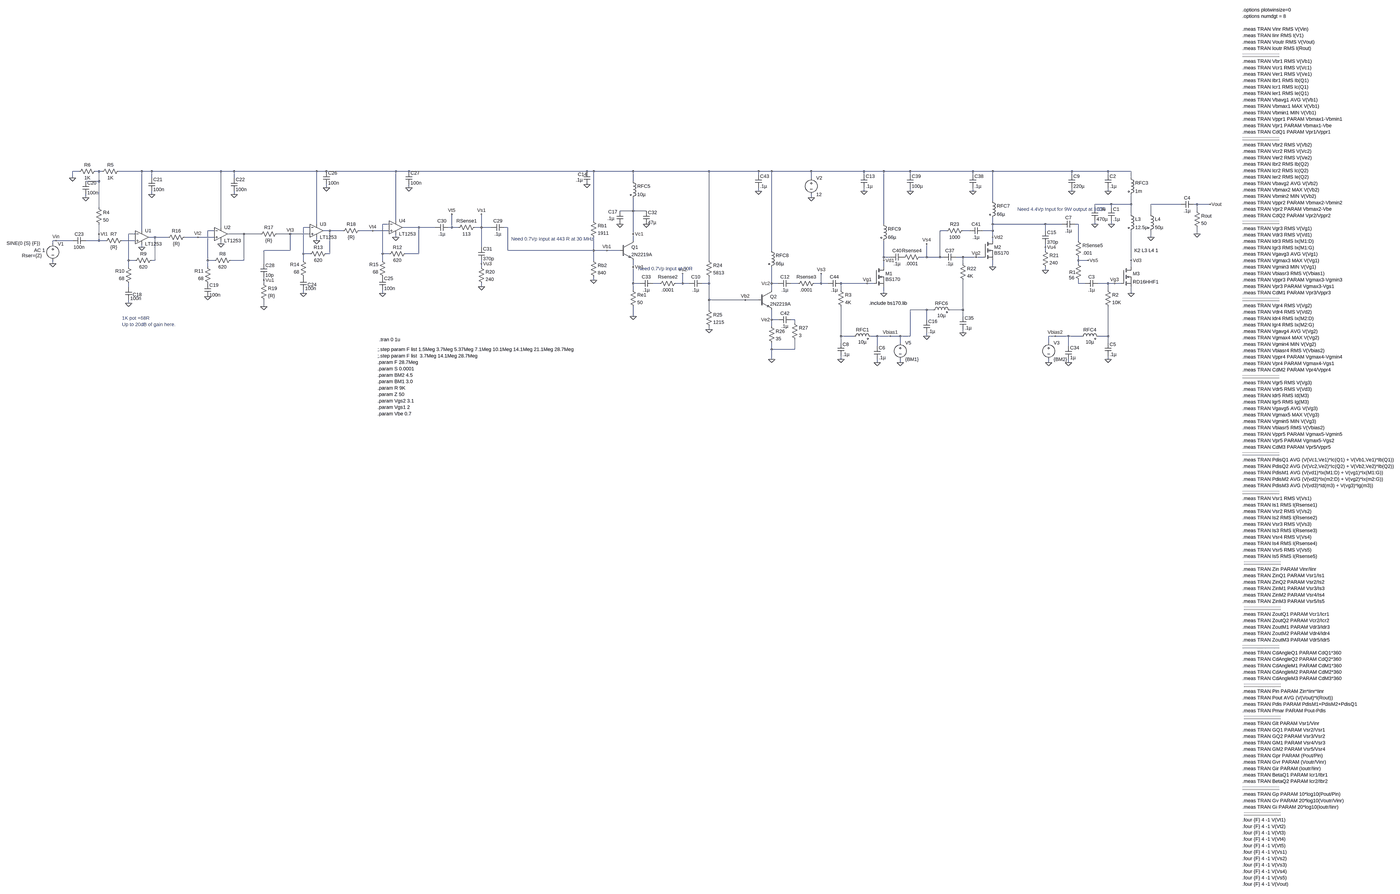
[diagram p0: schematic LT1253 2N2219 CC BS170x2 RD16HHF Power Amp Testing.asc, whole sheet]
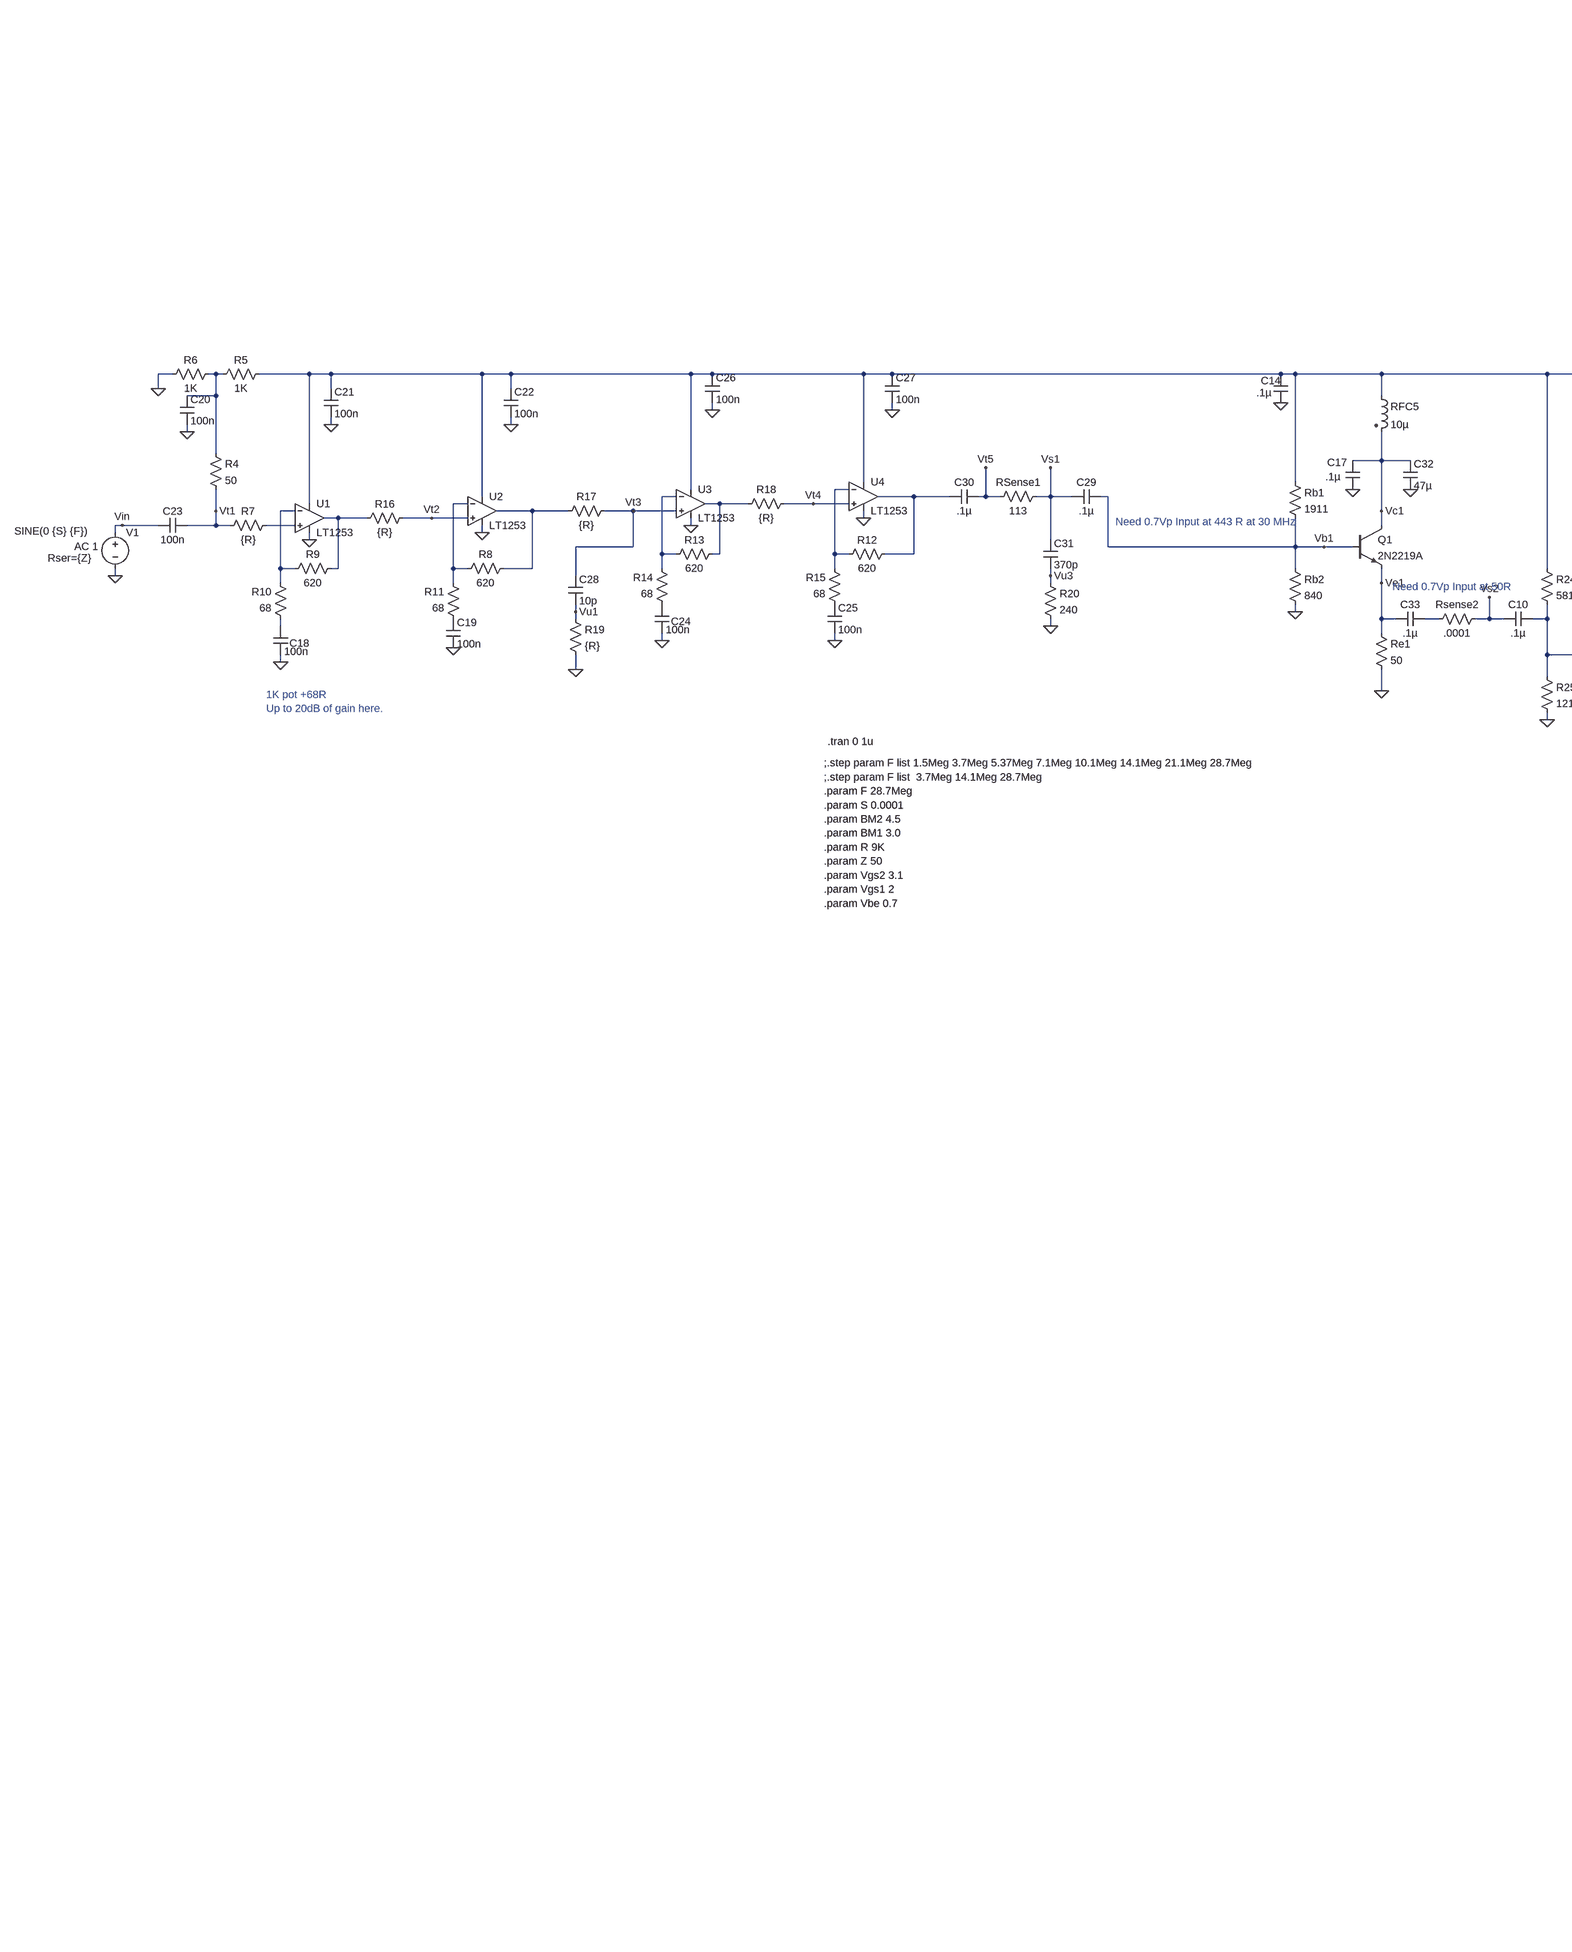
[diagram p1: schematic LT1253 2N2219 CC BS170x2 RD16HHF Power Amp Testing.asc, part, row 1 of 1, column 1 of 2]
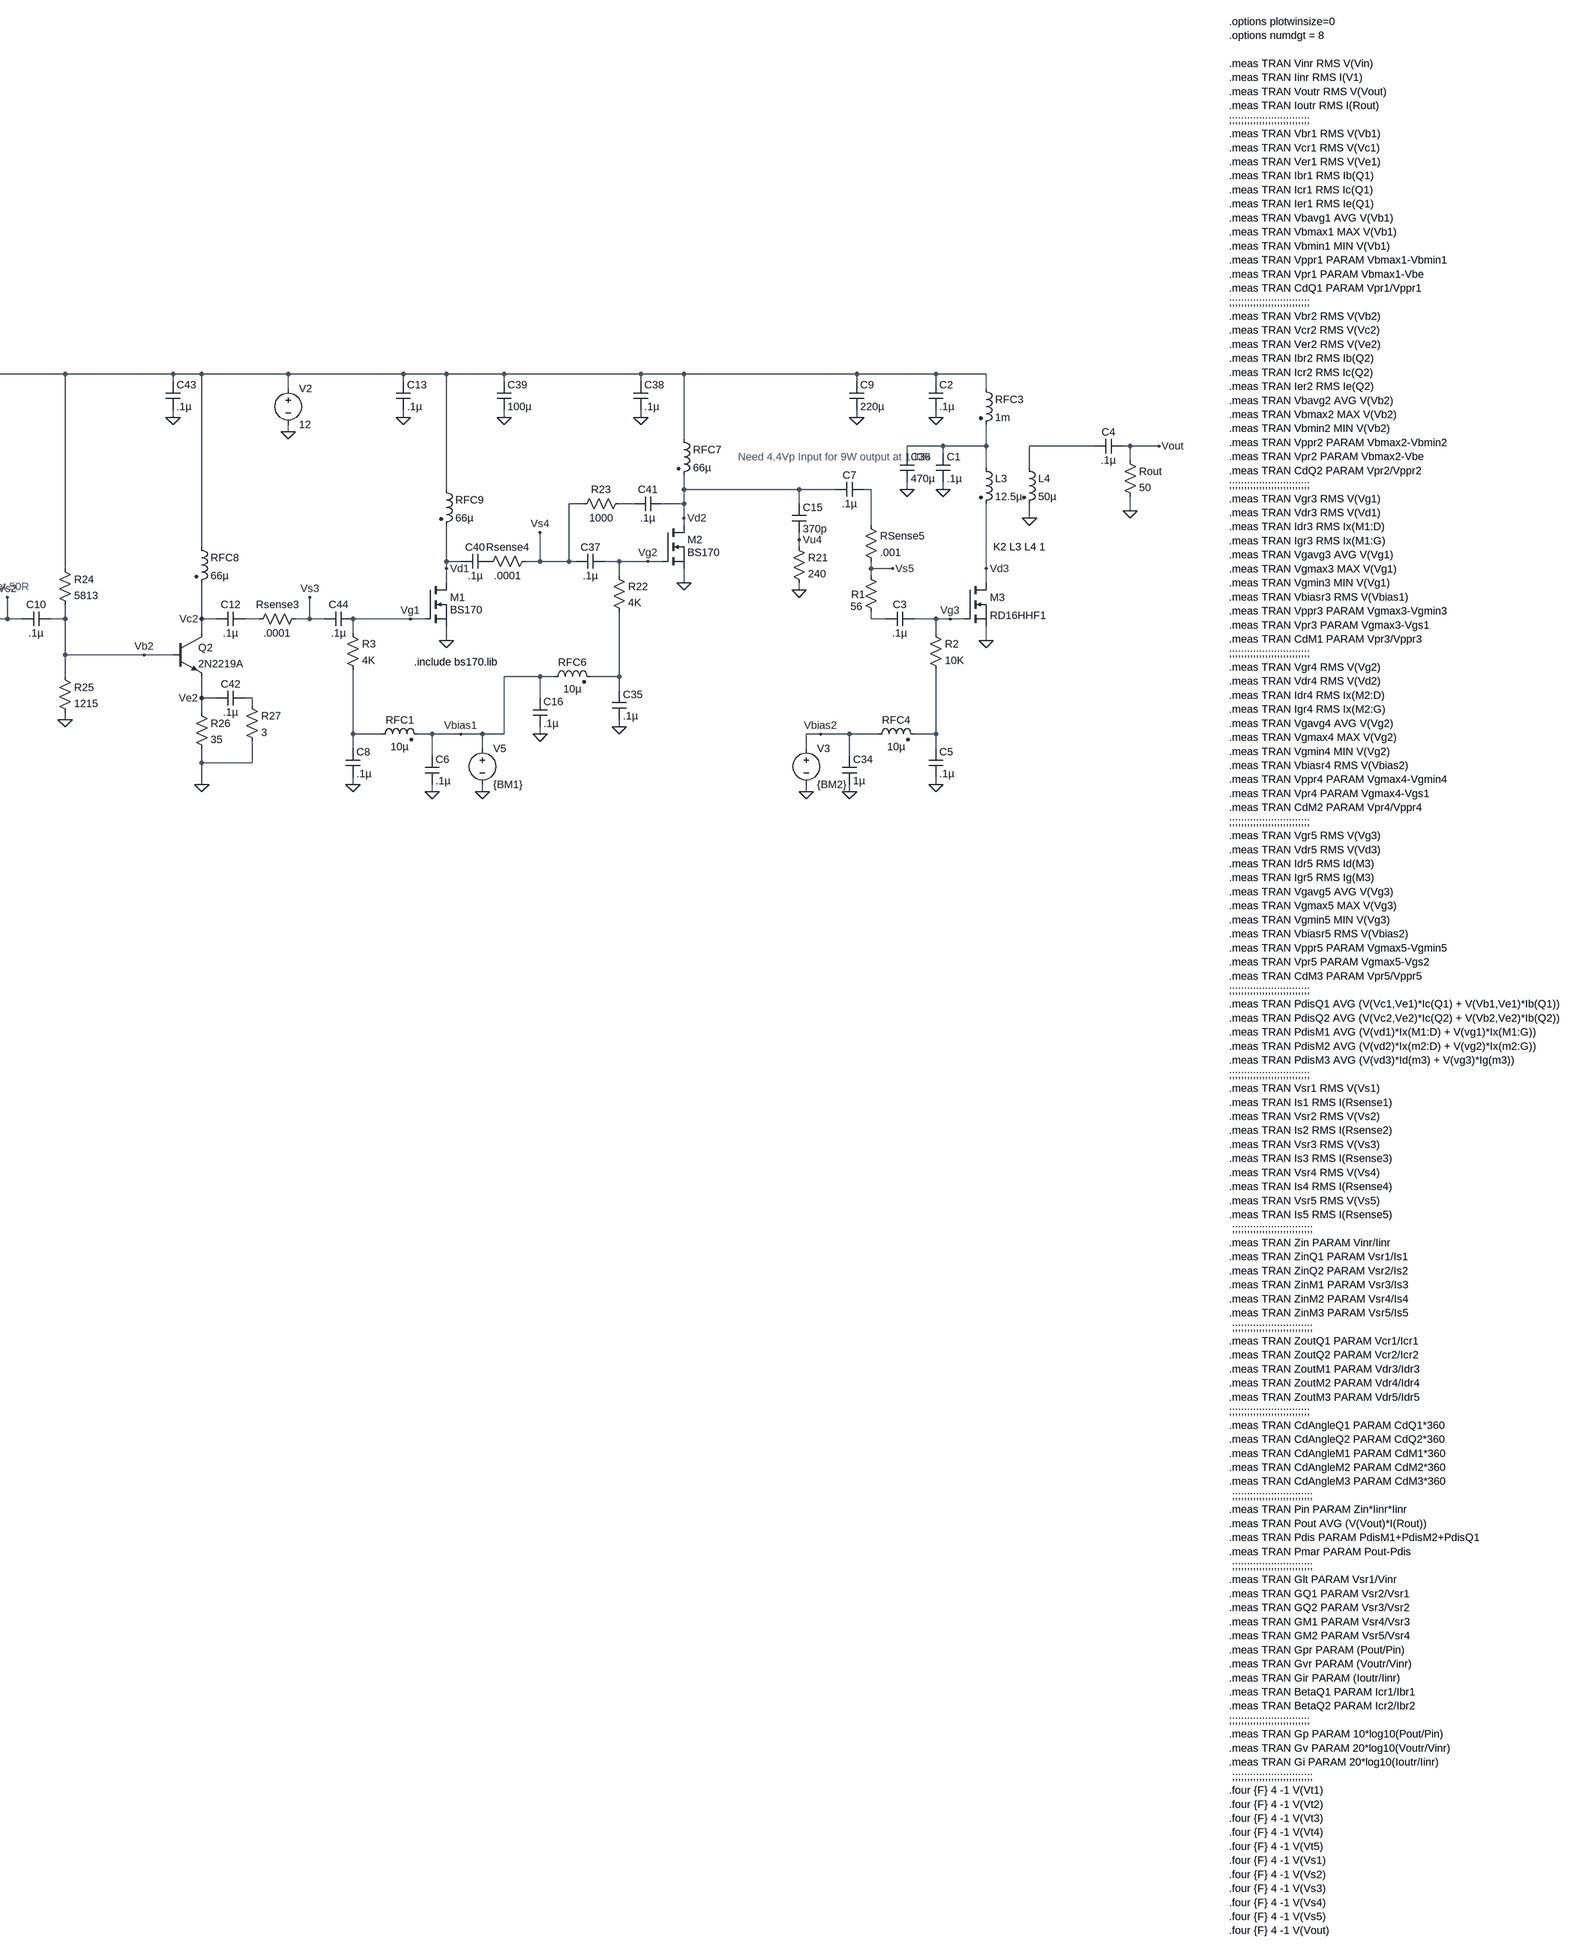
[diagram p2: schematic LT1253 2N2219 CC BS170x2 RD16HHF Power Amp Testing.asc, part, row 1 of 1, column 2 of 2]
LT1253 2N2219 CC BS170x2 RD16HHF Power Amp Testing.asc, the LTspice schematic file:
Version 4
SHEET 1 3484 2880
WIRE -3456 -160 -3488 -160
WIRE -3360 -160 -3376 -160
WIRE -3344 -160 -3360 -160
WIRE -3152 -160 -3264 -160
WIRE -3104 -160 -3152 -160
WIRE -2768 -160 -3104 -160
WIRE -2704 -160 -2768 -160
WIRE -2304 -160 -2704 -160
WIRE -2256 -160 -2304 -160
WIRE -1920 -160 -2256 -160
WIRE -1856 -160 -1920 -160
WIRE -992 -160 -1856 -160
WIRE -960 -160 -992 -160
WIRE -768 -160 -960 -160
WIRE -400 -160 -768 -160
WIRE -160 -160 -400 -160
WIRE -96 -160 -160 -160
WIRE 96 -160 -96 -160
WIRE 352 -160 96 -160
WIRE 448 -160 352 -160
WIRE 576 -160 448 -160
WIRE 880 -160 576 -160
WIRE 976 -160 880 -160
WIRE 1360 -160 976 -160
WIRE 1536 -160 1360 -160
WIRE 1648 -160 1536 -160
WIRE -160 -144 -160 -160
WIRE 352 -144 352 -160
WIRE 576 -144 576 -160
WIRE 880 -144 880 -160
WIRE 1360 -144 1360 -160
WIRE 1536 -144 1536 -160
WIRE -3488 -128 -3488 -160
WIRE -3104 -128 -3104 -160
WIRE -2704 -128 -2704 -160
WIRE 96 -128 96 -160
WIRE 1648 -128 1648 -160
WIRE -3360 -112 -3360 -160
WIRE -3360 -112 -3424 -112
WIRE -768 -112 -768 -160
WIRE -2256 -80 -2256 -96
WIRE -1856 -80 -1856 -96
WIRE -160 -64 -160 -80
WIRE 352 -64 352 -80
WIRE 576 -64 576 -80
WIRE 880 -64 880 -80
WIRE 1360 -64 1360 -80
WIRE 1536 -64 1536 -80
WIRE -3104 -48 -3104 -64
WIRE -2704 -48 -2704 -64
WIRE -3424 -32 -3424 -48
WIRE 96 -32 96 -48
WIRE 976 -16 976 -160
WIRE 1552 0 1472 0
WIRE 1648 0 1648 -48
WIRE 1648 0 1552 0
WIRE 1888 0 1744 0
WIRE 1968 0 1952 0
WIRE 2032 0 1968 0
WIRE -3360 16 -3360 -112
WIRE 1472 16 1472 0
WIRE 1552 16 1552 0
WIRE -768 32 -768 -32
WIRE -768 32 -832 32
WIRE -704 32 -768 32
WIRE 1968 32 1968 0
WIRE 1648 48 1648 0
WIRE 1744 48 1744 0
WIRE -1920 80 -1920 -160
WIRE -960 80 -960 -160
WIRE -2304 96 -2304 -160
WIRE -1952 96 -1984 96
WIRE 448 96 448 -160
WIRE 976 96 976 64
WIRE 1232 96 976 96
WIRE 1312 96 1232 96
WIRE 1392 96 1376 96
WIRE 1472 96 1472 80
WIRE 1552 96 1552 80
WIRE -2768 112 -2768 -160
WIRE -2336 112 -2368 112
WIRE -1808 112 -1888 112
WIRE -1728 112 -1808 112
WIRE -1648 112 -1648 48
WIRE -1648 112 -1664 112
WIRE -1616 112 -1648 112
WIRE -1504 112 -1504 48
WIRE -1504 112 -1536 112
WIRE -1456 112 -1504 112
WIRE -1376 112 -1392 112
WIRE -3152 128 -3152 -160
WIRE -2800 128 -2832 128
WIRE -2240 128 -2272 128
WIRE -2176 128 -2240 128
WIRE -2032 128 -2096 128
WIRE -1952 128 -2032 128
WIRE 752 128 720 128
WIRE 864 128 832 128
WIRE 976 128 976 96
WIRE 976 128 928 128
WIRE 1232 128 1232 96
WIRE -3360 144 -3360 96
WIRE -3184 144 -3216 144
WIRE -2656 144 -2736 144
WIRE -2576 144 -2656 144
WIRE -2432 144 -2496 144
WIRE -2336 144 -2432 144
WIRE -768 144 -768 32
WIRE 1968 144 1968 112
WIRE -3088 160 -3120 160
WIRE -3024 160 -3088 160
WIRE -2880 160 -2944 160
WIRE -2800 160 -2880 160
WIRE -1920 160 -1920 144
WIRE 976 160 976 128
WIRE 1744 160 1744 128
WIRE -3568 176 -3584 176
WIRE -3488 176 -3568 176
WIRE -3360 176 -3360 144
WIRE -3360 176 -3424 176
WIRE -3328 176 -3360 176
WIRE -3184 176 -3248 176
WIRE -2304 176 -2304 160
WIRE -768 176 -768 144
WIRE 976 176 976 160
WIRE 1392 176 1392 96
WIRE -3584 192 -3584 176
WIRE -2768 192 -2768 176
WIRE -3152 208 -3152 192
WIRE -1504 208 -1504 112
WIRE 1232 208 1232 192
WIRE -2432 224 -2432 144
WIRE -2432 224 -2560 224
WIRE -1376 224 -1376 112
WIRE -960 224 -960 160
WIRE -960 224 -1376 224
WIRE -896 224 -960 224
WIRE -832 224 -896 224
WIRE -96 224 -96 -160
WIRE 1232 224 1232 208
WIRE -2368 240 -2368 112
WIRE -2336 240 -2368 240
WIRE -2240 240 -2240 128
WIRE -2240 240 -2256 240
WIRE -1984 240 -1984 96
WIRE -1952 240 -1984 240
WIRE -1808 240 -1808 112
WIRE -1808 240 -1872 240
WIRE 448 256 448 176
WIRE 480 256 448 256
WIRE 656 256 656 192
WIRE 656 256 624 256
WIRE 720 256 720 128
WIRE 720 256 656 256
WIRE 736 256 720 256
WIRE 832 256 800 256
WIRE 896 256 832 256
WIRE 928 256 896 256
WIRE -3216 272 -3216 144
WIRE -3184 272 -3216 272
WIRE -3088 272 -3088 160
WIRE -3088 272 -3104 272
WIRE -2832 272 -2832 128
WIRE -2800 272 -2832 272
WIRE -2656 272 -2656 144
WIRE -2656 272 -2720 272
WIRE -2368 272 -2368 240
WIRE -1984 272 -1984 240
WIRE -960 272 -960 224
WIRE -400 272 -400 -160
WIRE 448 272 448 256
WIRE 1392 272 1392 256
WIRE 1440 272 1392 272
WIRE 1648 272 1648 128
WIRE -3584 288 -3584 272
WIRE -2560 288 -2560 224
WIRE -1504 288 -1504 272
WIRE 832 288 832 256
WIRE 1392 288 1392 272
WIRE -3216 304 -3216 272
WIRE -2832 304 -2832 272
WIRE -1504 304 -1504 288
WIRE -768 304 -768 272
WIRE 448 304 448 272
WIRE 976 304 976 272
WIRE 1648 304 1648 272
WIRE 1232 320 1232 304
WIRE -2560 368 -2560 352
WIRE -960 368 -960 352
WIRE -2560 384 -2560 368
WIRE -768 384 -768 304
WIRE -736 384 -768 384
WIRE -640 384 -672 384
WIRE -528 384 -528 336
WIRE -528 384 -560 384
WIRE -496 384 -528 384
WIRE -400 384 -400 352
WIRE -400 384 -432 384
WIRE -96 384 -96 304
WIRE -64 384 -96 384
WIRE 32 384 0 384
WIRE 144 384 144 336
WIRE 144 384 112 384
WIRE 176 384 144 384
WIRE 368 384 240 384
WIRE 400 384 368 384
WIRE 1392 384 1392 368
WIRE 1424 384 1392 384
WIRE 1536 384 1488 384
WIRE 1568 384 1536 384
WIRE 1600 384 1568 384
WIRE -3216 400 -3216 384
WIRE -1504 400 -1504 384
WIRE -768 416 -768 384
WIRE -96 416 -96 384
WIRE 240 416 240 384
WIRE 1536 416 1536 384
WIRE -2368 432 -2368 416
WIRE -1984 432 -1984 416
WIRE 448 432 448 400
WIRE 1648 432 1648 400
WIRE -400 464 -400 384
WIRE -224 464 -400 464
WIRE -160 464 -224 464
WIRE -3216 480 -3216 464
WIRE -2560 496 -2560 464
WIRE -400 512 -400 464
WIRE 656 512 576 512
WIRE 688 512 656 512
WIRE 832 512 832 368
WIRE 832 512 768 512
WIRE -768 544 -768 496
WIRE 832 544 832 512
WIRE -96 560 -96 512
WIRE -64 560 -96 560
WIRE 16 560 0 560
WIRE 656 560 656 512
WIRE 16 576 16 560
WIRE -96 592 -96 560
WIRE -400 608 -400 592
WIRE 832 624 832 608
WIRE 240 640 240 496
WIRE 304 640 240 640
WIRE 416 640 384 640
WIRE 480 640 416 640
WIRE 528 640 480 640
WIRE 576 640 576 512
WIRE 576 640 528 640
WIRE 656 640 656 624
WIRE 1280 640 1248 640
WIRE 1344 640 1280 640
WIRE 1408 640 1344 640
WIRE 1536 640 1536 496
WIRE 1536 640 1488 640
WIRE 240 672 240 640
WIRE 528 672 528 640
WIRE 1248 672 1248 640
WIRE 1536 672 1536 640
WIRE 416 688 416 640
WIRE 1344 688 1344 640
WIRE -96 704 -96 672
WIRE 16 704 16 656
WIRE 16 704 -96 704
WIRE -96 752 -96 704
WIRE 240 752 240 736
WIRE 1536 752 1536 736
WIRE 416 768 416 752
WIRE 528 768 528 752
WIRE 1248 768 1248 752
WIRE 1344 768 1344 752
FLAG 1968 144 0
FLAG 2032 0 Vout
FLAG -3584 288 0
FLAG -3568 176 Vin
FLAG 1648 432 0
FLAG 1568 384 Vg3
FLAG 1648 272 Vd3
FLAG 1552 96 0
FLAG 1536 -64 0
FLAG 1744 160 0
FLAG 1536 752 0
FLAG 1440 272 Vs5
FLAG 1248 768 0
FLAG 1280 640 Vbias2
FLAG 1360 -64 0
FLAG 1472 96 0
FLAG -960 368 0
FLAG -768 544 0
FLAG -896 224 Vb1
FLAG -768 304 Ve1
FLAG -768 144 Vc1
FLAG -992 -96 0
FLAG -832 96 0
FLAG -3104 -48 0
FLAG -3424 -32 0
FLAG -3152 208 0
FLAG -2768 192 0
FLAG -2832 448 0
FLAG -2704 -48 0
FLAG -3488 -128 0
FLAG -3216 480 0
FLAG -2256 -80 0
FLAG -2304 176 0
FLAG -1920 160 0
FLAG -1984 432 0
FLAG -1856 -80 0
FLAG -2368 432 0
FLAG -2560 368 Vu1
FLAG -2560 496 0
FLAG -1504 48 Vs1
FLAG -3360 144 Vt1
FLAG -2880 160 Vt2
FLAG -2432 144 Vt3
FLAG -1648 48 Vt5
FLAG -2032 128 Vt4
FLAG -1504 288 Vu3
FLAG -1504 400 0
FLAG -704 96 0
FLAG 1232 208 Vu4
FLAG 1232 320 0
FLAG 1344 768 0
FLAG 96 -32 0
FLAG 448 432 0
FLAG 368 384 Vg1
FLAG 448 272 Vd1
FLAG 416 768 0
FLAG 240 752 0
FLAG 528 768 0
FLAG 480 640 Vbias1
FLAG 352 -64 0
FLAG 976 304 0
FLAG 896 256 Vg2
FLAG 976 160 Vd2
FLAG 656 640 0
FLAG 832 624 0
FLAG 880 -64 0
FLAG 576 -64 0
FLAG 656 192 Vs4
FLAG -400 608 0
FLAG -96 752 0
FLAG -224 464 Vb2
FLAG -96 560 Ve2
FLAG -96 384 Vc2
FLAG -160 -64 0
FLAG 144 336 Vs3
FLAG -528 336 Vs2
SYMBOL res 1952 16 R0
SYMATTR InstName Rout
SYMATTR Value 50
SYMBOL voltage -3584 176 R0
WINDOW 123 -91 47 Left 2
WINDOW 39 -150 73 Left 2
WINDOW 3 -224 13 Left 2
SYMATTR Value2 AC 1
SYMATTR SpiceLine Rser={Z}
SYMATTR Value SINE(0 {S} {F})
SYMATTR InstName V1
SYMBOL cap 1888 16 R270
WINDOW 0 32 32 VTop 2
WINDOW 3 0 32 VBottom 2
SYMATTR InstName C4
SYMATTR Value .1µ
SYMBOL nmos 1600 304 R0
SYMATTR InstName M3
SYMATTR Value RD16HHF1
SYMBOL ind2 1632 32 R0
SYMATTR InstName L3
SYMATTR Value 12.5µ
SYMATTR Type ind
SYMBOL ind2 1632 -144 R0
SYMATTR InstName RFC3
SYMATTR Value 1m
SYMATTR Type ind
SYMBOL cap 1536 16 R0
SYMATTR InstName C1
SYMATTR Value .1µ
SYMBOL ind2 1728 32 R0
SYMATTR InstName L4
SYMATTR Value 50µ
SYMATTR Type ind
SYMBOL cap 1520 -144 R0
SYMATTR InstName C2
SYMATTR Value .1µ
SYMBOL res 1376 160 R0
SYMATTR InstName RSense5
SYMATTR Value .001
SYMBOL cap 1488 368 R90
WINDOW 0 0 32 VBottom 2
WINDOW 3 32 32 VTop 2
SYMATTR InstName C3
SYMATTR Value .1µ
SYMBOL res 1520 400 R0
SYMATTR InstName R2
SYMATTR Value 10K
SYMBOL ind2 1392 656 R270
WINDOW 0 32 56 VTop 2
WINDOW 3 4 56 VBottom 2
SYMATTR InstName RFC4
SYMATTR Value 10µ
SYMATTR Type ind
SYMBOL cap 1520 672 R0
SYMATTR InstName C5
SYMATTR Value .1µ
SYMBOL cap 1312 112 R270
WINDOW 0 32 32 VTop 2
WINDOW 3 0 32 VBottom 2
SYMATTR InstName C7
SYMATTR Value .1µ
SYMBOL voltage 1248 656 R0
WINDOW 123 0 0 Left 2
WINDOW 39 0 0 Left 2
SYMATTR InstName V3
SYMATTR Value {BM2}
SYMBOL cap 1344 -144 R0
SYMATTR InstName C9
SYMATTR Value 220µ
SYMBOL cap 1456 16 R0
SYMATTR InstName C36
SYMATTR Value 470µ
SYMBOL res 1376 272 R0
WINDOW 0 -28 58 Left 2
WINDOW 3 -30 84 Left 2
SYMATTR InstName R1
SYMATTR Value 56
SYMBOL res -976 64 R0
SYMATTR InstName Rb1
SYMATTR Value 1911
SYMBOL res -976 256 R0
SYMATTR InstName Rb2
SYMATTR Value 840
SYMBOL res -784 400 R0
SYMATTR InstName Re1
SYMATTR Value 50
SYMBOL npn -832 176 R0
SYMATTR InstName Q1
SYMATTR Value 2N2219A
SYMBOL cap -1008 -160 R0
WINDOW 0 -28 15 Left 2
WINDOW 3 -38 41 Left 2
SYMATTR InstName C14
SYMATTR Value .1µ
SYMBOL cap -848 32 R0
WINDOW 0 -41 4 Left 2
WINDOW 3 -45 36 Left 2
SYMATTR InstName C17
SYMATTR Value .1µ
SYMBOL Opamps\\LT1253 -3152 96 R0
SYMATTR InstName U1
SYMBOL Opamps\\LT1253 -2768 80 R0
SYMATTR InstName U2
SYMBOL res -3376 0 R0
SYMATTR InstName R4
SYMATTR Value 50
SYMBOL res -3248 -176 R90
WINDOW 0 0 56 VBottom 2
WINDOW 3 32 56 VTop 2
SYMATTR InstName R5
SYMATTR Value 1K
SYMBOL res -3360 -176 R90
WINDOW 0 0 56 VBottom 2
WINDOW 3 32 56 VTop 2
SYMATTR InstName R6
SYMATTR Value 1K
SYMBOL res -3232 160 R90
WINDOW 0 0 56 VBottom 2
WINDOW 3 32 56 VTop 2
SYMATTR InstName R7
SYMATTR Value {R}
SYMBOL res -2704 256 R90
WINDOW 0 0 56 VBottom 2
WINDOW 3 32 56 VTop 2
SYMATTR InstName R8
SYMATTR Value 620
SYMBOL res -3088 256 R90
WINDOW 0 0 56 VBottom 2
WINDOW 3 32 56 VTop 2
SYMATTR InstName R9
SYMATTR Value 620
SYMBOL res -3200 400 R180
WINDOW 0 36 76 Left 2
WINDOW 3 36 40 Left 2
SYMATTR InstName R10
SYMATTR Value 68
SYMBOL res -2816 400 R180
WINDOW 0 36 76 Left 2
WINDOW 3 36 40 Left 2
SYMATTR InstName R11
SYMATTR Value 68
SYMBOL cap -3232 400 R0
WINDOW 0 36 38 Left 2
SYMATTR InstName C18
SYMATTR Value 100n
SYMBOL cap -2848 384 R0
SYMATTR InstName C19
SYMATTR Value 100n
SYMBOL cap -3440 -112 R0
SYMATTR InstName C20
SYMATTR Value 100n
SYMBOL cap -3120 -128 R0
SYMATTR InstName C21
SYMATTR Value 100n
SYMBOL cap -2720 -128 R0
SYMATTR InstName C22
SYMATTR Value 100n
SYMBOL cap -3424 160 R90
WINDOW 0 0 32 VBottom 2
WINDOW 3 32 32 VTop 2
SYMATTR InstName C23
SYMATTR Value 100n
SYMBOL Opamps\\LT1253 -2304 64 R0
SYMATTR InstName U3
SYMBOL Opamps\\LT1253 -1920 48 R0
SYMATTR InstName U4
SYMBOL res -1856 224 R90
WINDOW 0 0 56 VBottom 2
WINDOW 3 32 56 VTop 2
SYMATTR InstName R12
SYMATTR Value 620
SYMBOL res -2240 224 R90
WINDOW 0 0 56 VBottom 2
WINDOW 3 32 56 VTop 2
SYMATTR InstName R13
SYMATTR Value 620
SYMBOL res -2352 368 R180
WINDOW 0 36 76 Left 2
WINDOW 3 36 40 Left 2
SYMATTR InstName R14
SYMATTR Value 68
SYMBOL res -1968 368 R180
WINDOW 0 36 76 Left 2
WINDOW 3 36 40 Left 2
SYMATTR InstName R15
SYMATTR Value 68
SYMBOL cap -2384 352 R0
WINDOW 0 36 38 Left 2
SYMATTR InstName C24
SYMATTR Value 100n
SYMBOL cap -2000 352 R0
SYMATTR InstName C25
SYMATTR Value 100n
SYMBOL cap -2272 -160 R0
SYMATTR InstName C26
SYMATTR Value 100n
SYMBOL cap -1872 -160 R0
SYMATTR InstName C27
SYMATTR Value 100n
SYMBOL res -2928 144 R90
WINDOW 0 0 56 VBottom 2
WINDOW 3 32 56 VTop 2
SYMATTR InstName R16
SYMATTR Value {R}
SYMBOL res -2480 128 R90
WINDOW 0 0 56 VBottom 2
WINDOW 3 32 56 VTop 2
SYMATTR InstName R17
SYMATTR Value {R}
SYMBOL res -2080 112 R90
WINDOW 0 0 56 VBottom 2
WINDOW 3 32 56 VTop 2
SYMATTR InstName R18
SYMATTR Value {R}
SYMBOL cap -2576 288 R0
SYMATTR InstName C28
SYMATTR Value 10p
SYMBOL res -2576 368 R0
SYMATTR InstName R19
SYMATTR Value {R}
SYMBOL cap -1456 128 R270
WINDOW 0 32 32 VTop 2
WINDOW 3 0 32 VBottom 2
SYMATTR InstName C29
SYMATTR Value .1µ
SYMBOL cap -1728 128 R270
WINDOW 0 32 32 VTop 2
WINDOW 3 0 32 VBottom 2
SYMATTR InstName C30
SYMATTR Value .1µ
SYMBOL res -1520 96 R90
WINDOW 0 0 56 VBottom 2
WINDOW 3 32 56 VTop 2
SYMATTR InstName RSense1
SYMATTR Value 113
SYMBOL cap -1520 208 R0
SYMATTR InstName C31
SYMATTR Value 370p
SYMBOL res -1520 288 R0
SYMATTR InstName R20
SYMATTR Value 240
SYMBOL ind2 -784 -128 R0
SYMATTR InstName RFC5
SYMATTR Value 10µ
SYMATTR Type ind
SYMBOL cap -720 32 R0
SYMATTR InstName C32
SYMATTR Value 47µ
SYMBOL cap -736 400 R270
WINDOW 0 32 32 VTop 2
WINDOW 3 0 32 VBottom 2
SYMATTR InstName C33
SYMATTR Value .1µ
SYMBOL cap 1216 128 R0
SYMATTR InstName C15
SYMATTR Value 370p
SYMBOL res 1216 208 R0
SYMATTR InstName R21
SYMATTR Value 240
SYMBOL cap 1328 688 R0
SYMATTR InstName C34
SYMATTR Value 1µ
SYMBOL voltage 96 -144 R0
WINDOW 123 0 0 Left 2
WINDOW 39 0 0 Left 2
SYMATTR InstName V2
SYMATTR Value 12
SYMBOL nmos 400 304 R0
WINDOW 3 56 60 Left 2
SYMATTR Value BS170
SYMATTR InstName M1
SYMATTR Prefix X
SYMBOL res 224 400 R0
SYMATTR InstName R3
SYMATTR Value 4K
SYMBOL ind2 288 656 R270
WINDOW 0 32 56 VTop 2
WINDOW 3 4 56 VBottom 2
SYMATTR InstName RFC1
SYMATTR Value 10µ
SYMATTR Type ind
SYMBOL cap 400 688 R0
SYMATTR InstName C6
SYMATTR Value .1µ
SYMBOL cap 224 672 R0
SYMATTR InstName C8
SYMATTR Value .1µ
SYMBOL voltage 528 656 R0
WINDOW 123 0 0 Left 2
WINDOW 39 0 0 Left 2
SYMATTR InstName V5
SYMATTR Value {BM1}
SYMBOL cap -64 400 R270
WINDOW 0 32 32 VTop 2
WINDOW 3 0 32 VBottom 2
SYMATTR InstName C12
SYMATTR Value .1µ
SYMBOL cap 336 -144 R0
SYMATTR InstName C13
SYMATTR Value .1µ
SYMBOL nmos 928 176 R0
WINDOW 3 56 60 Left 2
SYMATTR Value BS170
SYMATTR InstName M2
SYMATTR Prefix X
SYMBOL res 816 272 R0
SYMATTR InstName R22
SYMATTR Value 4K
SYMBOL ind2 672 528 R270
WINDOW 0 32 56 VTop 2
WINDOW 3 4 56 VBottom 2
SYMATTR InstName RFC6
SYMATTR Value 10µ
SYMATTR Type ind
SYMBOL cap 640 560 R0
SYMATTR InstName C16
SYMATTR Value .1µ
SYMBOL cap 816 544 R0
SYMATTR InstName C35
SYMATTR Value .1µ
SYMBOL ind2 960 -32 R0
SYMATTR InstName RFC7
SYMATTR Value 66µ
SYMATTR Type ind
SYMBOL cap 736 272 R270
WINDOW 0 32 32 VTop 2
WINDOW 3 0 32 VBottom 2
SYMATTR InstName C37
SYMATTR Value .1µ
SYMBOL cap 864 -144 R0
SYMATTR InstName C38
SYMATTR Value .1µ
SYMBOL cap 560 -144 R0
SYMATTR InstName C39
SYMATTR Value 100µ
SYMBOL cap 480 272 R270
WINDOW 0 32 32 VTop 2
WINDOW 3 0 32 VBottom 2
SYMATTR InstName C40
SYMATTR Value .1µ
SYMBOL res 640 240 R90
WINDOW 0 0 56 VBottom 2
WINDOW 3 32 56 VTop 2
SYMATTR InstName Rsense4
SYMATTR Value .0001
SYMBOL cap 928 112 R90
WINDOW 0 0 32 VBottom 2
WINDOW 3 32 32 VTop 2
SYMATTR InstName C41
SYMATTR Value .1µ
SYMBOL res 848 112 R90
WINDOW 0 0 56 VBottom 2
WINDOW 3 32 56 VTop 2
SYMATTR InstName R23
SYMATTR Value 1000
SYMBOL res -416 256 R0
SYMATTR InstName R24
SYMATTR Value 5813
SYMBOL res -416 496 R0
SYMATTR InstName R25
SYMATTR Value 1215
SYMBOL res -112 576 R0
SYMATTR InstName R26
SYMATTR Value 35
SYMBOL cap 0 544 R90
WINDOW 0 0 32 VBottom 2
WINDOW 3 32 32 VTop 2
SYMATTR InstName C42
SYMATTR Value .1µ
SYMBOL npn -160 416 R0
SYMATTR InstName Q2
SYMATTR Value 2N2219A
SYMBOL res 0 560 R0
SYMATTR InstName R27
SYMATTR Value 3
SYMBOL ind2 -112 208 R0
SYMATTR InstName RFC8
SYMATTR Value 66µ
SYMATTR Type ind
SYMBOL ind2 432 80 R0
SYMATTR InstName RFC9
SYMATTR Value 66µ
SYMATTR Type ind
SYMBOL cap -176 -144 R0
SYMATTR InstName C43
SYMATTR Value .1µ
SYMBOL cap 176 400 R270
WINDOW 0 32 32 VTop 2
WINDOW 3 0 32 VBottom 2
SYMATTR InstName C44
SYMATTR Value .1µ
SYMBOL res 128 368 R90
WINDOW 0 0 56 VBottom 2
WINDOW 3 32 56 VTop 2
SYMATTR InstName Rsense3
SYMATTR Value .0001
SYMBOL res -544 368 R90
WINDOW 0 0 56 VBottom 2
WINDOW 3 32 56 VTop 2
SYMATTR InstName Rsense2
SYMATTR Value .0001
SYMBOL cap -496 400 R270
WINDOW 0 32 32 VTop 2
WINDOW 3 0 32 VBottom 2
SYMATTR InstName C10
SYMATTR Value .1µ
TEXT -2000 656 Left 2 !.tran 0 1u
TEXT 2696 -944 Left 2 !.options plotwinsize=0\n.options numdgt = 8\n \n.meas TRAN Vinr RMS V(Vin)\n.meas TRAN Iinr RMS I(V1)\n.meas TRAN Voutr RMS V(Vout)\n.meas TRAN Ioutr RMS I(Rout)\n;;;;;;;;;;;;;;;;;;;;;;;;;;;\n.meas TRAN Vbr1 RMS V(Vb1)\n.meas TRAN Vcr1 RMS V(Vc1)\n.meas TRAN Ver1 RMS V(Ve1)\n.meas TRAN Ibr1 RMS Ib(Q1)\n.meas TRAN Icr1 RMS Ic(Q1)\n.meas TRAN Ier1 RMS Ie(Q1)\n.meas TRAN Vbavg1 AVG V(Vb1)\n.meas TRAN Vbmax1 MAX V(Vb1)\n.meas TRAN Vbmin1 MIN V(Vb1)\n.meas TRAN Vppr1 PARAM Vbmax1-Vbmin1\n.meas TRAN Vpr1 PARAM Vbmax1-Vbe\n.meas TRAN CdQ1 PARAM Vpr1/Vppr1\n;;;;;;;;;;;;;;;;;;;;;;;;;;;\n.meas TRAN Vbr2 RMS V(Vb2)\n.meas TRAN Vcr2 RMS V(Vc2)\n.meas TRAN Ver2 RMS V(Ve2)\n.meas TRAN Ibr2 RMS Ib(Q2)\n.meas TRAN Icr2 RMS Ic(Q2)\n.meas TRAN Ier2 RMS Ie(Q2)\n.meas TRAN Vbavg2 AVG V(Vb2)\n.meas TRAN Vbmax2 MAX V(Vb2)\n.meas TRAN Vbmin2 MIN V(Vb2)\n.meas TRAN Vppr2 PARAM Vbmax2-Vbmin2\n.meas TRAN Vpr2 PARAM Vbmax2-Vbe\n.meas TRAN CdQ2 PARAM Vpr2/Vppr2\n;;;;;;;;;;;;;;;;;;;;;;;;;;;\n.meas TRAN Vgr3 RMS V(Vg1)\n.meas TRAN Vdr3 RMS V(Vd1)\n.meas TRAN Idr3 RMS Ix(M1:D)\n.meas TRAN Igr3 RMS Ix(M1:G)\n.meas TRAN Vgavg3 AVG V(Vg1)\n.meas TRAN Vgmax3 MAX V(Vg1)\n.meas TRAN Vgmin3 MIN V(Vg1)\n.meas TRAN Vbiasr3 RMS V(Vbias1)\n.meas TRAN Vppr3 PARAM Vgmax3-Vgmin3\n.meas TRAN Vpr3 PARAM Vgmax3-Vgs1\n.meas TRAN CdM1 PARAM Vpr3/Vppr3\n;;;;;;;;;;;;;;;;;;;;;;;;;;;\n.meas TRAN Vgr4 RMS V(Vg2)\n.meas TRAN Vdr4 RMS V(Vd2)\n.meas TRAN Idr4 RMS Ix(M2:D)\n.meas TRAN Igr4 RMS Ix(M2:G)\n.meas TRAN Vgavg4 AVG V(Vg2)\n.meas TRAN Vgmax4 MAX V(Vg2)\n.meas TRAN Vgmin4 MIN V(Vg2)\n.meas TRAN Vbiasr4 RMS V(Vbias2)\n.meas TRAN Vppr4 PARAM Vgmax4-Vgmin4\n.meas TRAN Vpr4 PARAM Vgmax4-Vgs1\n.meas TRAN CdM2 PARAM Vpr4/Vppr4\n;;;;;;;;;;;;;;;;;;;;;;;;;;;\n.meas TRAN Vgr5 RMS V(Vg3)\n.meas TRAN Vdr5 RMS V(Vd3)\n.meas TRAN Idr5 RMS Id(M3)\n.meas TRAN Igr5 RMS Ig(M3)\n.meas TRAN Vgavg5 AVG V(Vg3)\n.meas TRAN Vgmax5 MAX V(Vg3)\n.meas TRAN Vgmin5 MIN V(Vg3)\n.meas TRAN Vbiasr5 RMS V(Vbias2)\n.meas TRAN Vppr5 PARAM Vgmax5-Vgmin5\n.meas TRAN Vpr5 PARAM Vgmax5-Vgs2\n.meas TRAN CdM3 PARAM Vpr5/Vppr5\n;;;;;;;;;;;;;;;;;;;;;;;;;;;\n.meas TRAN PdisQ1 AVG (V(Vc1,Ve1)*Ic(Q1) + V(Vb1,Ve1)*Ib(Q1))\n.meas TRAN PdisQ2 AVG (V(Vc2,Ve2)*Ic(Q2) + V(Vb2,Ve2)*Ib(Q2))\n.meas TRAN PdisM1 AVG (V(vd1)*Ix(M1:D) + V(vg1)*Ix(M1:G))\n.meas TRAN PdisM2 AVG (V(vd2)*Ix(m2:D) + V(vg2)*Ix(m2:G))\n.meas TRAN PdisM3 AVG (V(vd3)*Id(m3) + V(vg3)*Ig(m3))\n;;;;;;;;;;;;;;;;;;;;;;;;;;;\n.meas TRAN Vsr1 RMS V(Vs1)\n.meas TRAN Is1 RMS I(Rsense1)\n.meas TRAN Vsr2 RMS V(Vs2)\n.meas TRAN Is2 RMS I(Rsense2)\n.meas TRAN Vsr3 RMS V(Vs3)\n.meas TRAN Is3 RMS I(Rsense3)\n.meas TRAN Vsr4 RMS V(Vs4)\n.meas TRAN Is4 RMS I(Rsense4)\n.meas TRAN Vsr5 RMS V(Vs5)\n.meas TRAN Is5 RMS I(Rsense5)\n ;;;;;;;;;;;;;;;;;;;;;;;;;;;\n.meas TRAN Zin PARAM Vinr/Iinr\n.meas TRAN ZinQ1 PARAM Vsr1/Is1\n.meas TRAN ZinQ2 PARAM Vsr2/Is2\n.meas TRAN ZinM1 PARAM Vsr3/Is3\n.meas TRAN ZinM2 PARAM Vsr4/Is4\n.meas TRAN ZinM3 PARAM Vsr5/Is5\n ;;;;;;;;;;;;;;;;;;;;;;;;;;; \n.meas TRAN ZoutQ1 PARAM Vcr1/Icr1\n.meas TRAN ZoutQ2 PARAM Vcr2/Icr2\n.meas TRAN ZoutM1 PARAM Vdr3/Idr3\n.meas TRAN ZoutM2 PARAM Vdr4/Idr4\n.meas TRAN ZoutM3 PARAM Vdr5/Idr5\n;;;;;;;;;;;;;;;;;;;;;;;;;;;\n.meas TRAN CdAngleQ1 PARAM CdQ1*360\n.meas TRAN CdAngleQ2 PARAM CdQ2*360\n.meas TRAN CdAngleM1 PARAM CdM1*360\n.meas TRAN CdAngleM2 PARAM CdM2*360\n.meas TRAN CdAngleM3 PARAM CdM3*360\n ;;;;;;;;;;;;;;;;;;;;;;;;;;;\n.meas TRAN Pin PARAM Zin*Iinr*Iinr\n.meas TRAN Pout AVG (V(Vout)*I(Rout))\n.meas TRAN Pdis PARAM PdisM1+PdisM2+PdisQ1\n.meas TRAN Pmar PARAM Pout-Pdis\n ;;;;;;;;;;;;;;;;;;;;;;;;;;;\n.meas TRAN Glt PARAM Vsr1/Vinr\n.meas TRAN GQ1 PARAM Vsr2/Vsr1\n.meas TRAN GQ2 PARAM Vsr3/Vsr2\n.meas TRAN GM1 PARAM Vsr4/Vsr3\n.meas TRAN GM2 PARAM Vsr5/Vsr4\n.meas TRAN Gpr PARAM (Pout/Pin)\n.meas TRAN Gvr PARAM (Voutr/Vinr)\n.meas TRAN Gir PARAM (Ioutr/Iinr)\n.meas TRAN BetaQ1 PARAM Icr1/Ibr1\n.meas TRAN BetaQ2 PARAM Icr2/Ibr2\n;;;;;;;;;;;;;;;;;;;;;;;;;;;\n.meas TRAN Gp PARAM 10*log10(Pout/Pin)\n.meas TRAN Gv PARAM 20*log10(Voutr/Vinr)\n.meas TRAN Gi PARAM 20*log10(Ioutr/Iinr)\n ;;;;;;;;;;;;;;;;;;;;;;;;;;;\n.four {F} 4 -1 V(Vt1)\n.four {F} 4 -1 V(Vt2)\n.four {F} 4 -1 V(Vt3)\n.four {F} 4 -1 V(Vt4)\n.four {F} 4 -1 V(Vt5)\n.four {F} 4 -1 V(Vs1)\n.four {F} 4 -1 V(Vs2)\n.four {F} 4 -1 V(Vs3)\n.four {F} 4 -1 V(Vs4)\n.four {F} 4 -1 V(Vs5)\n.four {F} 4 -1 V(Vout)
TEXT -2008 704 Left 2 !;.step param F list 1.5Meg 3.7Meg 5.37Meg 7.1Meg 10.1Meg 14.1Meg 21.1Meg 28.7Meg\n;.step param F list  3.7Meg 14.1Meg 28.7Meg\n.param F 28.7Meg\n.param S 0.0001\n.param BM2 4.5\n.param BM1 3.0\n.param R 9K\n.param Z 50\n.param Vgs2 3.1\n.param Vgs1 2\n.param Vbe 0.7
TEXT 1664 224 Left 2 !K2 L3 L4 1
TEXT 1096 24 Left 2 ;Need 4.4Vp Input for 9W output at 100R
TEXT -1360 168 Left 2 ;Need 0.7Vp Input at 443 R at 30 MHz
TEXT -744 312 Left 2 ;Need 0.7Vp Input at 50R
TEXT -3248 552 Left 2 ;1K pot +68R  \nUp to 20dB of gain here.
TEXT 376 480 Left 2 !.include bs170.lib

The netlist it stands for:
* LT1253 2N2219 CC BS170x2 RD16HHF Power Amp Testing.asc
Rout Vout 0 50
V1 Vin 0 SINE(0 {S} {F}) AC 1 Rser={Z}
C4 N004 Vout .1µ
M3 Vd3 Vg3 0 0 RD16HHF1
L3 N003 Vd3 12.5µ
L§RFC3 N002 N003 1m
C1 N003 0 .1µ
L4 N004 0 50µ
C2 N002 0 .1µ
RSense5 N006 Vs5 .001
C3 Vg3 N018 .1µ
R2 Vg3 N023 10K
L§RFC4 Vbias2 N023 10µ
C5 N023 0 .1µ
C7 Vd2 N006 .1µ
V3 Vbias2 0 {BM2}
C9 N002 0 220µ
C36 N003 0 470µ
R1 Vs5 N018 56
Rb1 N002 Vb1 1911
Rb2 Vb1 0 840
Re1 Ve1 0 50
Q1 Vc1 Vb1 Ve1 0 2N2219A
C14 N002 0 .1µ
C17 Vc1 0 .1µ
XU1 N015 N012 N002 0 N014 LT1253  ; pins In+ In- V+ V- OUT
XU2 Vt2 N009 N002 0 N013 LT1253  ; pins In+ In- V+ V- OUT
R4 N001 Vt1 50
R5 N002 N001 1K
R6 N001 0 1K
R7 N015 Vt1 {R}
R8 N013 N009 620
R9 N014 N012 620
R10 N019 N012 68
R11 P001 N009 68
C18 N019 0 100n
C19 P001 0 100n
C20 N001 0 100n
C21 N002 0 100n
C22 N002 0 100n
C23 Vt1 Vin 100n
XU3 Vt3 N007 N002 0 N010 LT1253  ; pins In+ In- V+ V- OUT
XU4 Vt4 N005 N002 0 N008 LT1253  ; pins In+ In- V+ V- OUT
R12 N008 N005 620
R13 N010 N007 620
R14 P002 N007 68
R15 P003 N005 68
C24 P002 0 100n
C25 P003 0 100n
C26 N002 0 100n
C27 N002 0 100n
R16 Vt2 N014 {R}
R17 Vt3 N013 {R}
R18 Vt4 N010 {R}
C28 Vt3 Vu1 10p
R19 Vu1 0 {R}
C29 Vs1 Vb1 .1µ
C30 N008 Vt5 .1µ
RSense1 Vs1 Vt5 113
C31 Vs1 Vu3 370p
R20 Vu3 0 240
L§RFC5 N002 Vc1 10µ
C32 Vc1 0 47µ
C33 Ve1 N016 .1µ
C15 Vd2 Vu4 370p
R21 Vu4 0 240
C34 Vbias2 0 1µ
V2 N002 0 12
XM1 Vd1 Vg1 0 BS170  ; pins D G S
R3 Vg1 N022 4K
L§RFC1 N022 Vbias1 10µ
C6 Vbias1 0 .1µ
C8 N022 0 .1µ
V5 Vbias1 0 {BM1}
C12 Vc2 N017 .1µ
C13 N002 0 .1µ
XM2 Vd2 Vg2 0 BS170  ; pins D G S
R22 Vg2 N020 4K
L§RFC6 Vbias1 N020 10µ
C16 Vbias1 0 .1µ
C35 N020 0 .1µ
L§RFC7 N002 Vd2 66µ
C37 Vs4 Vg2 .1µ
C38 N002 0 .1µ
C39 N002 0 100µ
C40 Vd1 P004 .1µ
Rsense4 Vs4 P004 .0001
C41 Vd2 N011 .1µ
R23 N011 Vs4 1000
R24 N002 Vb2 5813
R25 Vb2 0 1215
R26 Ve2 0 35
C42 N021 Ve2 .1µ
Q2 Vc2 Vb2 Ve2 0 2N2219A
R27 N021 0 3
L§RFC8 N002 Vc2 66µ
L§RFC9 N002 Vd1 66µ
C43 N002 0 .1µ
C44 Vs3 Vg1 .1µ
Rsense3 Vs3 N017 .0001
Rsense2 Vs2 N016 .0001
C10 Vs2 Vb2 .1µ
.model NPN NPN
.model PNP PNP
.lib standard.bjt
.model NMOS NMOS
.model PMOS PMOS
.lib standard.mos
.tran 0 1u
.options plotwinsize=0
.options numdgt = 8
.meas TRAN Vinr RMS V(Vin)
.meas TRAN Iinr RMS I(V1)
.meas TRAN Voutr RMS V(Vout)
.meas TRAN Ioutr RMS I(Rout)
;;;;;;;;;;;;;;;;;;;;;;;;;;;
.meas TRAN Vbr1 RMS V(Vb1)
.meas TRAN Vcr1 RMS V(Vc1)
.meas TRAN Ver1 RMS V(Ve1)
.meas TRAN Ibr1 RMS Ib(Q1)
.meas TRAN Icr1 RMS Ic(Q1)
.meas TRAN Ier1 RMS Ie(Q1)
.meas TRAN Vbavg1 AVG V(Vb1)
.meas TRAN Vbmax1 MAX V(Vb1)
.meas TRAN Vbmin1 MIN V(Vb1)
.meas TRAN Vppr1 PARAM Vbmax1-Vbmin1
.meas TRAN Vpr1 PARAM Vbmax1-Vbe
.meas TRAN CdQ1 PARAM Vpr1/Vppr1
;;;;;;;;;;;;;;;;;;;;;;;;;;;
.meas TRAN Vbr2 RMS V(Vb2)
.meas TRAN Vcr2 RMS V(Vc2)
.meas TRAN Ver2 RMS V(Ve2)
.meas TRAN Ibr2 RMS Ib(Q2)
.meas TRAN Icr2 RMS Ic(Q2)
.meas TRAN Ier2 RMS Ie(Q2)
.meas TRAN Vbavg2 AVG V(Vb2)
.meas TRAN Vbmax2 MAX V(Vb2)
.meas TRAN Vbmin2 MIN V(Vb2)
.meas TRAN Vppr2 PARAM Vbmax2-Vbmin2
.meas TRAN Vpr2 PARAM Vbmax2-Vbe
.meas TRAN CdQ2 PARAM Vpr2/Vppr2
;;;;;;;;;;;;;;;;;;;;;;;;;;;
.meas TRAN Vgr3 RMS V(Vg1)
.meas TRAN Vdr3 RMS V(Vd1)
.meas TRAN Idr3 RMS Ix(M1:D)
.meas TRAN Igr3 RMS Ix(M1:G)
.meas TRAN Vgavg3 AVG V(Vg1)
.meas TRAN Vgmax3 MAX V(Vg1)
.meas TRAN Vgmin3 MIN V(Vg1)
.meas TRAN Vbiasr3 RMS V(Vbias1)
.meas TRAN Vppr3 PARAM Vgmax3-Vgmin3
.meas TRAN Vpr3 PARAM Vgmax3-Vgs1
.meas TRAN CdM1 PARAM Vpr3/Vppr3
;;;;;;;;;;;;;;;;;;;;;;;;;;;
.meas TRAN Vgr4 RMS V(Vg2)
.meas TRAN Vdr4 RMS V(Vd2)
.meas TRAN Idr4 RMS Ix(M2:D)
.meas TRAN Igr4 RMS Ix(M2:G)
.meas TRAN Vgavg4 AVG V(Vg2)
.meas TRAN Vgmax4 MAX V(Vg2)
.meas TRAN Vgmin4 MIN V(Vg2)
.meas TRAN Vbiasr4 RMS V(Vbias2)
.meas TRAN Vppr4 PARAM Vgmax4-Vgmin4
.meas TRAN Vpr4 PARAM Vgmax4-Vgs1
.meas TRAN CdM2 PARAM Vpr4/Vppr4
;;;;;;;;;;;;;;;;;;;;;;;;;;;
.meas TRAN Vgr5 RMS V(Vg3)
.meas TRAN Vdr5 RMS V(Vd3)
.meas TRAN Idr5 RMS Id(M3)
.meas TRAN Igr5 RMS Ig(M3)
.meas TRAN Vgavg5 AVG V(Vg3)
.meas TRAN Vgmax5 MAX V(Vg3)
.meas TRAN Vgmin5 MIN V(Vg3)
.meas TRAN Vbiasr5 RMS V(Vbias2)
.meas TRAN Vppr5 PARAM Vgmax5-Vgmin5
.meas TRAN Vpr5 PARAM Vgmax5-Vgs2
.meas TRAN CdM3 PARAM Vpr5/Vppr5
;;;;;;;;;;;;;;;;;;;;;;;;;;;
.meas TRAN PdisQ1 AVG (V(Vc1,Ve1)*Ic(Q1) + V(Vb1,Ve1)*Ib(Q1))
.meas TRAN PdisQ2 AVG (V(Vc2,Ve2)*Ic(Q2) + V(Vb2,Ve2)*Ib(Q2))
.meas TRAN PdisM1 AVG (V(vd1)*Ix(M1:D) + V(vg1)*Ix(M1:G))
.meas TRAN PdisM2 AVG (V(vd2)*Ix(m2:D) + V(vg2)*Ix(m2:G))
.meas TRAN PdisM3 AVG (V(vd3)*Id(m3) + V(vg3)*Ig(m3))
;;;;;;;;;;;;;;;;;;;;;;;;;;;
.meas TRAN Vsr1 RMS V(Vs1)
.meas TRAN Is1 RMS I(Rsense1)
.meas TRAN Vsr2 RMS V(Vs2)
.meas TRAN Is2 RMS I(Rsense2)
.meas TRAN Vsr3 RMS V(Vs3)
.meas TRAN Is3 RMS I(Rsense3)
.meas TRAN Vsr4 RMS V(Vs4)
.meas TRAN Is4 RMS I(Rsense4)
.meas TRAN Vsr5 RMS V(Vs5)
.meas TRAN Is5 RMS I(Rsense5)
 ;;;;;;;;;;;;;;;;;;;;;;;;;;;
.meas TRAN Zin PARAM Vinr/Iinr
.meas TRAN ZinQ1 PARAM Vsr1/Is1
.meas TRAN ZinQ2 PARAM Vsr2/Is2
.meas TRAN ZinM1 PARAM Vsr3/Is3
.meas TRAN ZinM2 PARAM Vsr4/Is4
.meas TRAN ZinM3 PARAM Vsr5/Is5
 ;;;;;;;;;;;;;;;;;;;;;;;;;;;
.meas TRAN ZoutQ1 PARAM Vcr1/Icr1
.meas TRAN ZoutQ2 PARAM Vcr2/Icr2
.meas TRAN ZoutM1 PARAM Vdr3/Idr3
.meas TRAN ZoutM2 PARAM Vdr4/Idr4
.meas TRAN ZoutM3 PARAM Vdr5/Idr5
;;;;;;;;;;;;;;;;;;;;;;;;;;;
.meas TRAN CdAngleQ1 PARAM CdQ1*360
.meas TRAN CdAngleQ2 PARAM CdQ2*360
.meas TRAN CdAngleM1 PARAM CdM1*360
.meas TRAN CdAngleM2 PARAM CdM2*360
.meas TRAN CdAngleM3 PARAM CdM3*360
 ;;;;;;;;;;;;;;;;;;;;;;;;;;;
.meas TRAN Pin PARAM Zin*Iinr*Iinr
.meas TRAN Pout AVG (V(Vout)*I(Rout))
.meas TRAN Pdis PARAM PdisM1+PdisM2+PdisQ1
.meas TRAN Pmar PARAM Pout-Pdis
 ;;;;;;;;;;;;;;;;;;;;;;;;;;;
.meas TRAN Glt PARAM Vsr1/Vinr
.meas TRAN GQ1 PARAM Vsr2/Vsr1
.meas TRAN GQ2 PARAM Vsr3/Vsr2
.meas TRAN GM1 PARAM Vsr4/Vsr3
.meas TRAN GM2 PARAM Vsr5/Vsr4
.meas TRAN Gpr PARAM (Pout/Pin)
.meas TRAN Gvr PARAM (Voutr/Vinr)
.meas TRAN Gir PARAM (Ioutr/Iinr)
.meas TRAN BetaQ1 PARAM Icr1/Ibr1
.meas TRAN BetaQ2 PARAM Icr2/Ibr2
;;;;;;;;;;;;;;;;;;;;;;;;;;;
.meas TRAN Gp PARAM 10*log10(Pout/Pin)
.meas TRAN Gv PARAM 20*log10(Voutr/Vinr)
.meas TRAN Gi PARAM 20*log10(Ioutr/Iinr)
 ;;;;;;;;;;;;;;;;;;;;;;;;;;;
.four {F} 4 -1 V(Vt1)
.four {F} 4 -1 V(Vt2)
.four {F} 4 -1 V(Vt3)
.four {F} 4 -1 V(Vt4)
.four {F} 4 -1 V(Vt5)
.four {F} 4 -1 V(Vs1)
.four {F} 4 -1 V(Vs2)
.four {F} 4 -1 V(Vs3)
.four {F} 4 -1 V(Vs4)
.four {F} 4 -1 V(Vs5)
.four {F} 4 -1 V(Vout)
;.step param F list 1.5Meg 3.7Meg 5.37Meg 7.1Meg 10.1Meg 14.1Meg 21.1Meg 28.7Meg
;.step param F list  3.7Meg 14.1Meg 28.7Meg
.param F 28.7Meg
.param S 0.0001
.param BM2 4.5
.param BM1 3.0
.param R 9K
.param Z 50
.param Vgs2 3.1
.param Vgs1 2
.param Vbe 0.7
K2 L3 L4 1
* Need 4.4Vp Input for 9W output at 100R
* Need 0.7Vp Input at 443 R at 30 MHz
* Need 0.7Vp Input at 50R
* 1K pot +68R
* Up to 20dB of gain here.
.include bs170.lib
.backanno
.end